# Altium project Street_light_driver_hv2.PrjPcb
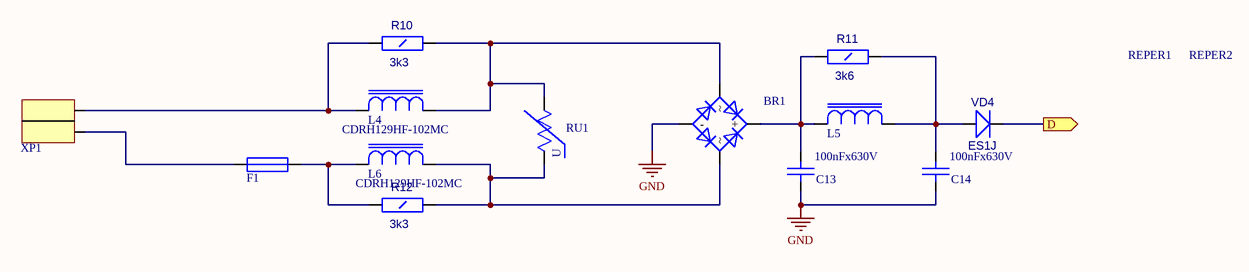
[diagram p0: Main.SchDoc]
2 sheets, 49 parts. Net scope: flat (ports and power ports of the same name join across sheets).
Board file: Street_light_driver_hv2.PcbDoc
Sheets:
  Main.SchDoc
  ICS.SchDoc

## Sheet Main.SchDoc
size A4

### Parts
BR1  DF10S  [SDIP]  (value not drawn)
C13  100nFx630V  [CAP_630V_SMD]
C14  100nFx630V  [CAP_630V_SMD]
F1  *  [Fuse Belfuse]  (value not drawn)
L4  CDRH129HF-102MC  [IND_CDRH129]
L5  CDRH129HF-102MC  [IND_CDRH129]  (value not drawn)
L6  CDRH129HF-102MC  [IND_CDRH129]
R10  3k3  [RC1206]
R11  3k6  [RC1206]
R12  3k3  [RC1206]
REPER1  REPER1.2  [REPER1.2]  (value not drawn)
REPER2  REPER1.2  [REPER1.2]  (value not drawn)
RU1  KLS6-07D  [Varistor_7mm_SMD]  (value not drawn)
VD4  ES1J  [SMA]
XP1  *  [Poke-In 2pin]  (value not drawn)

### Ports
D (out)

### Nets
GND: BR1.4(-) C13.1(A) C14.1(A)
NetBR1_1: BR1.1 L4.2(B) R10.2(B) RU1.2(B)
NetBR1_2: BR1.2 L6.2(B) R12.2(B) RU1.1(A)
NetBR1_3: BR1.3(+) C13.2(B) L5.1(A) R11.1(A)
NetC14_2: C14.2(B) L5.2(B) R11.2(B) VD4.1(A)
NetDA1_6: VD4.2(K) ; port D
NetF1_1: F1.1 XP1.4
NetF1_2: F1.2 L6.1(A) R12.1(A)
NetL4_1: L4.1(A) R10.1(A) XP1.3

Not connected (* = marked no-connect by the designer): REPER1 1; REPER2 1

### Notes on the sheet
- (in symbol KLS6-07D) U

### Library data of the parts
C13 C14 = Cap_HV: Value: 100nFx630V
F1 = Fuse Belufse: Value: *
L4-L6 = CDRH129: Value: CDRH129HF-102MC
R10-R12 = RC1206
  R10 R12: Value: 3k3
  R11: Value: 3k6
VD4 = SS14: Schottky Rectifier; OriginalName: 10BQ100; ComponentField6: Published 8-Jun-2000, Modified 10-July-2000: SIM Model Added.; Value: ES1J
XP1 = Poke-IN 2Pin: Value: *
BR1 = DF10S: Value: DF10S
REPER1 REPER2 = REPER1.2: Value: *
RU1 = KLS6-07D: Value: KLS6-07D

## Sheet ICS.SchDoc
size A4
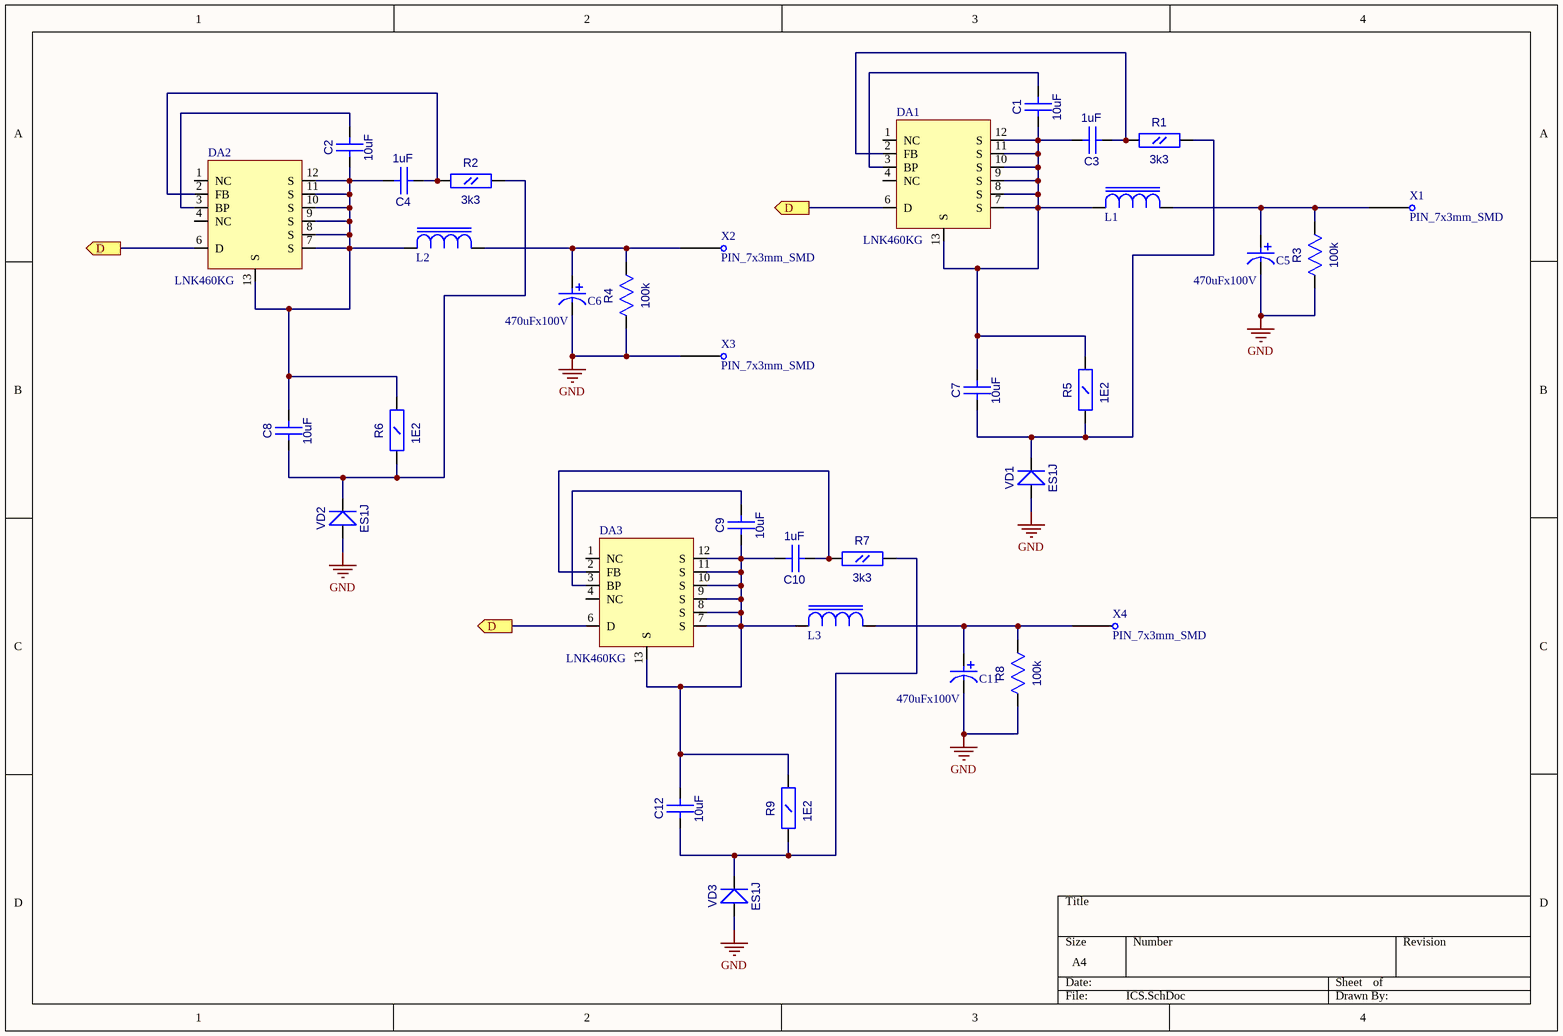
[diagram p1: ICS.SchDoc]

### Parts
C1  10uF  [CC1206]
C2  10uF  [CC1206]
C3  1uF  [CC0805]
C4  1uF  [CC0805]
C5  470uFx100V  [CAP_7.5_SMD_2]
C6  470uFx100V  [CAP_7.5_SMD_2]
C7  10uF  [CC1206]
C8  10uF  [CC1206]
C9  10uF  [CC1206]
C10  1uF  [CC0805]
C11  470uFx100V  [CAP_7.5_SMD_2]
C12  10uF  [CC1206]
DA1  LNK460KG  [eSOP-12]
DA2  LNK460KG  [eSOP-12]
DA3  LNK460KG  [eSOP-12]
L1  CDRH129HF-331MC  [IND_CDRH129]  (value not drawn)
L2  CDRH129HF-331MC  [IND_CDRH129]  (value not drawn)
L3  CDRH129HF-331MC  [IND_CDRH129]  (value not drawn)
R1  3k3  [RC0805]
R2  3k3  [RC0805]
R3  100k  [RC0805]
R4  100k  [RC0805]
R5  1E2  [RC1206]
R6  1E2  [RC1206]
R7  3k3  [RC0805]
R8  100k  [RC0805]
R9  1E2  [RC1206]
VD1  ES1J  [SMA]
VD2  ES1J  [SMA]
VD3  ES1J  [SMA]
X1  PIN_7x3mm_SMD  [PIN_7x3mm_SMD]
X2  PIN_7x3mm_SMD  [PIN_7x3mm_SMD]
X3  PIN_7x3mm_SMD  [PIN_7x3mm_SMD]
X4  PIN_7x3mm_SMD  [PIN_7x3mm_SMD]

### Ports
D (out)

### Nets
GND: C5.1 C6.1 C11.1 R3.1(A) R4.1(A) R8.1(A) VD1.1(A) VD2.1(A) VD3.1(A) X3.1
NetC1_1: C1.1(A) C3.2(B) C7.2(B) DA1.7(S) DA1.8(S) DA1.9(S) DA1.10(S) DA1.11(S) DA1.12(S) DA1.13(S) L1.1(A) R5.2(B)
NetC1_2: C1.2(B) DA1.3(BP)
NetC2_1: C2.1(A) C4.2(B) C8.2(B) DA2.7(S) DA2.8(S) DA2.9(S) DA2.10(S) DA2.11(S) DA2.12(S) DA2.13(S) L2.1(A) R6.2(B)
NetC2_2: C2.2(B) DA2.3(BP)
NetC3_1: C3.1(A) DA1.2(FB) R1.1(A)
NetC4_1: C4.1(A) DA2.2(FB) R2.1(A)
NetC5_2: C5.2 L1.2(B) R3.2(B) X1.1
NetC6_2: C6.2 L2.2(B) R4.2(B) X2.1
NetC7_1: C7.1(A) R1.2(B) R5.1(A) VD1.2(K)
NetC8_1: C8.1(A) R2.2(B) R6.1(A) VD2.2(K)
NetC9_1: C9.1(A) C10.2(B) C12.2(B) DA3.7(S) DA3.8(S) DA3.9(S) DA3.10(S) DA3.11(S) DA3.12(S) DA3.13(S) L3.1(A) R9.2(B)
NetC9_2: C9.2(B) DA3.3(BP)
NetC10_1: C10.1(A) DA3.2(FB) R7.1(A)
NetC11_2: C11.2 L3.2(B) R8.2(B) X4.1
NetC12_1: C12.1(A) R7.2(B) R9.1(A) VD3.2(K)
NetDA1_6: DA1.6(D) DA2.6(D) DA3.6(D) ; port D

Not connected (* = marked no-connect by the designer): DA1 1(NC) 4(NC); DA2 1(NC) 4(NC); DA3 1(NC) 4(NC)

### Library data of the parts
C1 C2 C7-C9 C12 = CC1206: Value: 10uF
C3 C4 C10 = CC0805: Value: 1uF
C5 C6 C11 = CAP_16x25: Value: 470uFx100V
L1-L3 = CDRH129: Value: CDRH129HF-331MC
R1-R4 R7 R8 = RC0805
  R1 R2 R7: Value: 3k3
  R3 R4 R8: Value: 100k
R5 R6 R9 = RC1206: Value: 1E2
VD1-VD3 = SS14: Schottky Rectifier; Value: ES1J
DA1-DA3 = LNK460KG: Value: LNK460KG

## Nets that join several sheets
GND: Main (BR1.4 C13.1 C14.1), ICS (10 pins)
NetDA1_6: Main (VD4.2), ICS (DA1.6 DA2.6 DA3.6)